# Altium schematic sheet MCU_SUPPORT_CCU_HAS.SchDoc: CCU - Microcontroller Support
size B; DrawnBy: M. Seago; Organization: Gravitas; Address1: Sponsored By:; Address2: Alan Morgan; Address3: Technical Advisor:; Address4: Dr. Joseph Morgan; Revision: 1A; SheetNumber: 1; SheetTotal: 9
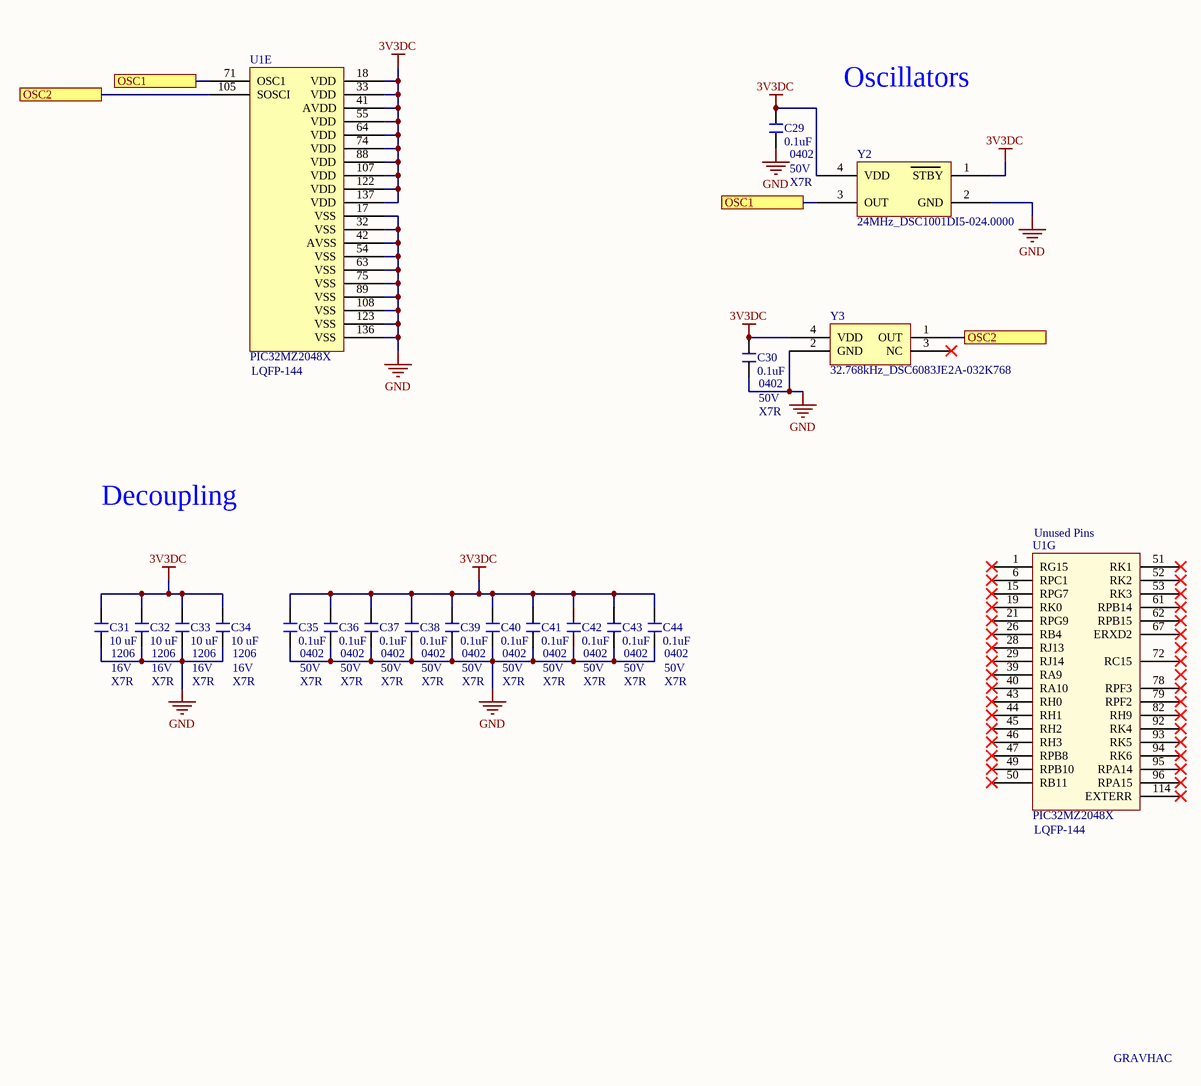
[diagram p0: MCU_SUPPORT_CCU_HAS.SchDoc]

## Parts
C29  0.1uF  [NonPolar-0402]
C30  0.1uF  [NonPolar-0402]
C31  10 uF  [NONPOLAR-1206]
C32  10 uF  [NONPOLAR-1206]
C33  10 uF  [NONPOLAR-1206]
C34  10 uF  [NONPOLAR-1206]
C35  0.1uF  [NonPolar-0402]
C36  0.1uF  [NonPolar-0402]
C37  0.1uF  [NonPolar-0402]
C38  0.1uF  [NonPolar-0402]
C39  0.1uF  [NonPolar-0402]
C40  0.1uF  [NonPolar-0402]
C41  0.1uF  [NonPolar-0402]
C42  0.1uF  [NonPolar-0402]
C43  0.1uF  [NonPolar-0402]
C44  0.1uF  [NonPolar-0402]
U1  PIC32MZ2048X  [BIG_PIC32MZ]  (parts E,G of 7)
Y2  24MHz_DSC1001DI5-024.0000  [12MHz_DSC1001DE2-012.0000]
Y3  32.768kHz_DSC6083JE2A-032K768  [32.768kHz_DSC6083JE2A-032K768]

## Ports
OSC1, OSC2

## Nets
3V3DC: C29.2 C30.2 C31.2 C32.2 C33.2 C34.2 C35.2 C36.2 C37.2 C38.2 C39.2 C40.2 C41.2 C42.2 C43.2 C44.2 U1.18(VDD) U1.33(VDD) U1.41(AVDD) U1.55(VDD) U1.64(VDD) U1.74(VDD) U1.88(VDD) U1.107(VDD) U1.122(VDD) U1.137(VDD) Y2.1(STBY) Y2.4(VDD) Y3.4(VDD)
GND: C29.1 C30.1 C31.1 C32.1 C33.1 C34.1 C35.1 C36.1 C37.1 C38.1 C39.1 C40.1 C41.1 C42.1 C43.1 C44.1 U1.17(VSS) U1.32(VSS) U1.42(AVSS) U1.54(VSS) U1.63(VSS) U1.75(VSS) U1.89(VSS) U1.108(VSS) U1.123(VSS) U1.136(VSS) Y2.2(GND) Y3.2(GND)
OSC1: U1.71(OSC1) Y2.3(OUT) ; port OSC1
OSC2: U1.105(SOSCI) Y3.1(OUT) ; port OSC2

Not connected (* = marked no-connect by the designer): U1 1(RG15)* 6(RPC1)* 15(RPG7)* 19(RK0)* 21(RPG9)* 26(RB4)* 28(RJ13)* 29(RJ14)* 39(RA9)* 40(RA10)* 43(RH0)* 44(RH1)* 45(RH2)* 46(RH3)* 47(RPB8)* 49(RPB10)* 50(RB11)* 51(RK1)* 52(RK2)* 53(RK3)* 61(RPB14)* 62(RPB15)* 67(ERXD2)* 72(RC15)* 78(RPF3)* 79(RPF2)* 82(RH9)* 92(RK4)* 93(RK5)* 94(RK6)* 95(RPA14)* 96(RPA15)* 114(EXTERR)*; Y3 3(NC)*

## Notes on the sheet
- Oscillators
- (near C29) 0402
- 50V
- X7R
- (near U1) LQFP-144
- (near C30) 0402
- (near C30) 50V
- (near C30) X7R
- Decoupling
- (near U1) Unused Pins
- 1206
- 16V
- (near C34) 1206
- 0402
- (near C44) 0402
- (near C44) 50V
- GRAVHAC
- Title
- Size:
- Date:
- B
- Drawn By:
- Revision:
- Sheet
- of
- File:

## Library data of the parts
C29 C30 C35-C44 = Cap - 0402
C31-C34 = Cap - 1206: CGA5L1X7R1E106K160AE